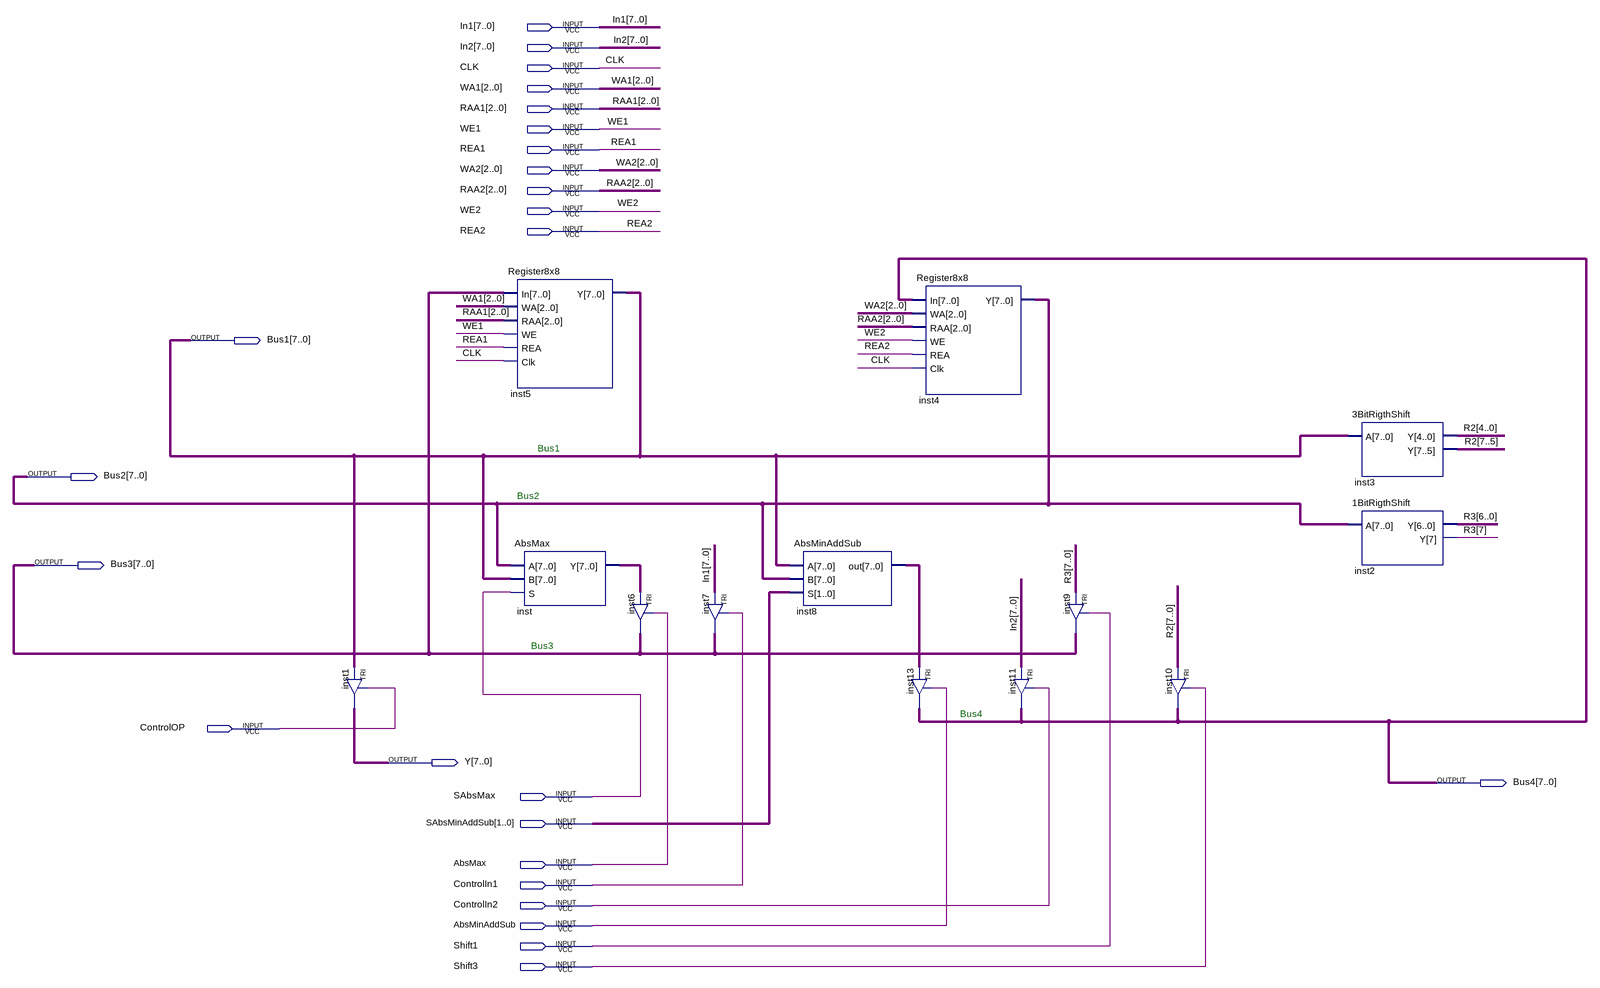
[diagram p0: schematic sheet]
// Quartus schematic Datapath.bdf as structural Verilog: 13 symbols, 25 pins
module Datapath (
  input  [7:0] In1,
  input  [7:0] In2,
  input  CLK,
  input  [2:0] WA1,
  input  [2:0] RAA1,
  input  WE1,
  input  REA1,
  input  [2:0] WA2,
  input  [2:0] RAA2,
  input  WE2,
  input  REA2,
  input  ControlOP,
  input  SAbsMax,
  input  [1:0] SAbsMinAddSub,
  input  AbsMax,
  input  ControlIn1,
  input  ControlIn2,
  input  AbsMinAddSub,
  input  Shift1,
  input  Shift3,
  output [7:0] Bus1,
  output [7:0] Bus2,
  output [7:0] Bus3,
  output [7:0] Y,
  output [7:0] Bus4
);

  wire [7:0] inst8_out, inst_y, R2, R3;

  TRI inst1[7:0] (.IN(Bus1), .OE(ControlOP), .OUT(Y));
  Register8x8 inst5 (.In(Bus3), .WA(WA1), .RAA(RAA1), .WE(WE1), .REA(REA1), .Clk(CLK), .Y(Bus1));
  AbsMax inst (.A(Bus2), .B(Bus1), .S(SAbsMax), .Y(inst_y));
  TRI inst6[7:0] (.IN(inst_y), .OE(AbsMax), .OUT(Bus3));
  TRI inst7[7:0] (.IN(In1), .OE(ControlIn1), .OUT(Bus3));
  AbsMinAddSub inst8 (.A(Bus1), .B(Bus2), .S(SAbsMinAddSub), .out(inst8_out));
  Register8x8 inst4 (.In(Bus4), .WA(WA2), .RAA(RAA2), .WE(WE2), .REA(REA2), .Clk(CLK), .Y(Bus2));
  TRI inst13[7:0] (.IN(inst8_out), .OE(AbsMinAddSub), .OUT(Bus4));
  TRI inst11[7:0] (.IN(In2), .OE(ControlIn2), .OUT(Bus4));
  TRI inst9[7:0] (.IN(R3), .OE(Shift1), .OUT(Bus3));
  TRI inst10[7:0] (.IN(R2), .OE(Shift3), .OUT(Bus4));
  \3BitRigthShift  inst3 (.A(Bus1), .Y(R2));
  \1BitRigthShift  inst2 (.A(Bus2), .Y(R3));

  // Notes on the sheet:
  //   Bus1
  //   Bus2
  //   Bus3
  //   Bus4
endmodule
